# EAGLE design haasoscope_pro_clock_board (EAGLE 9.6.2)
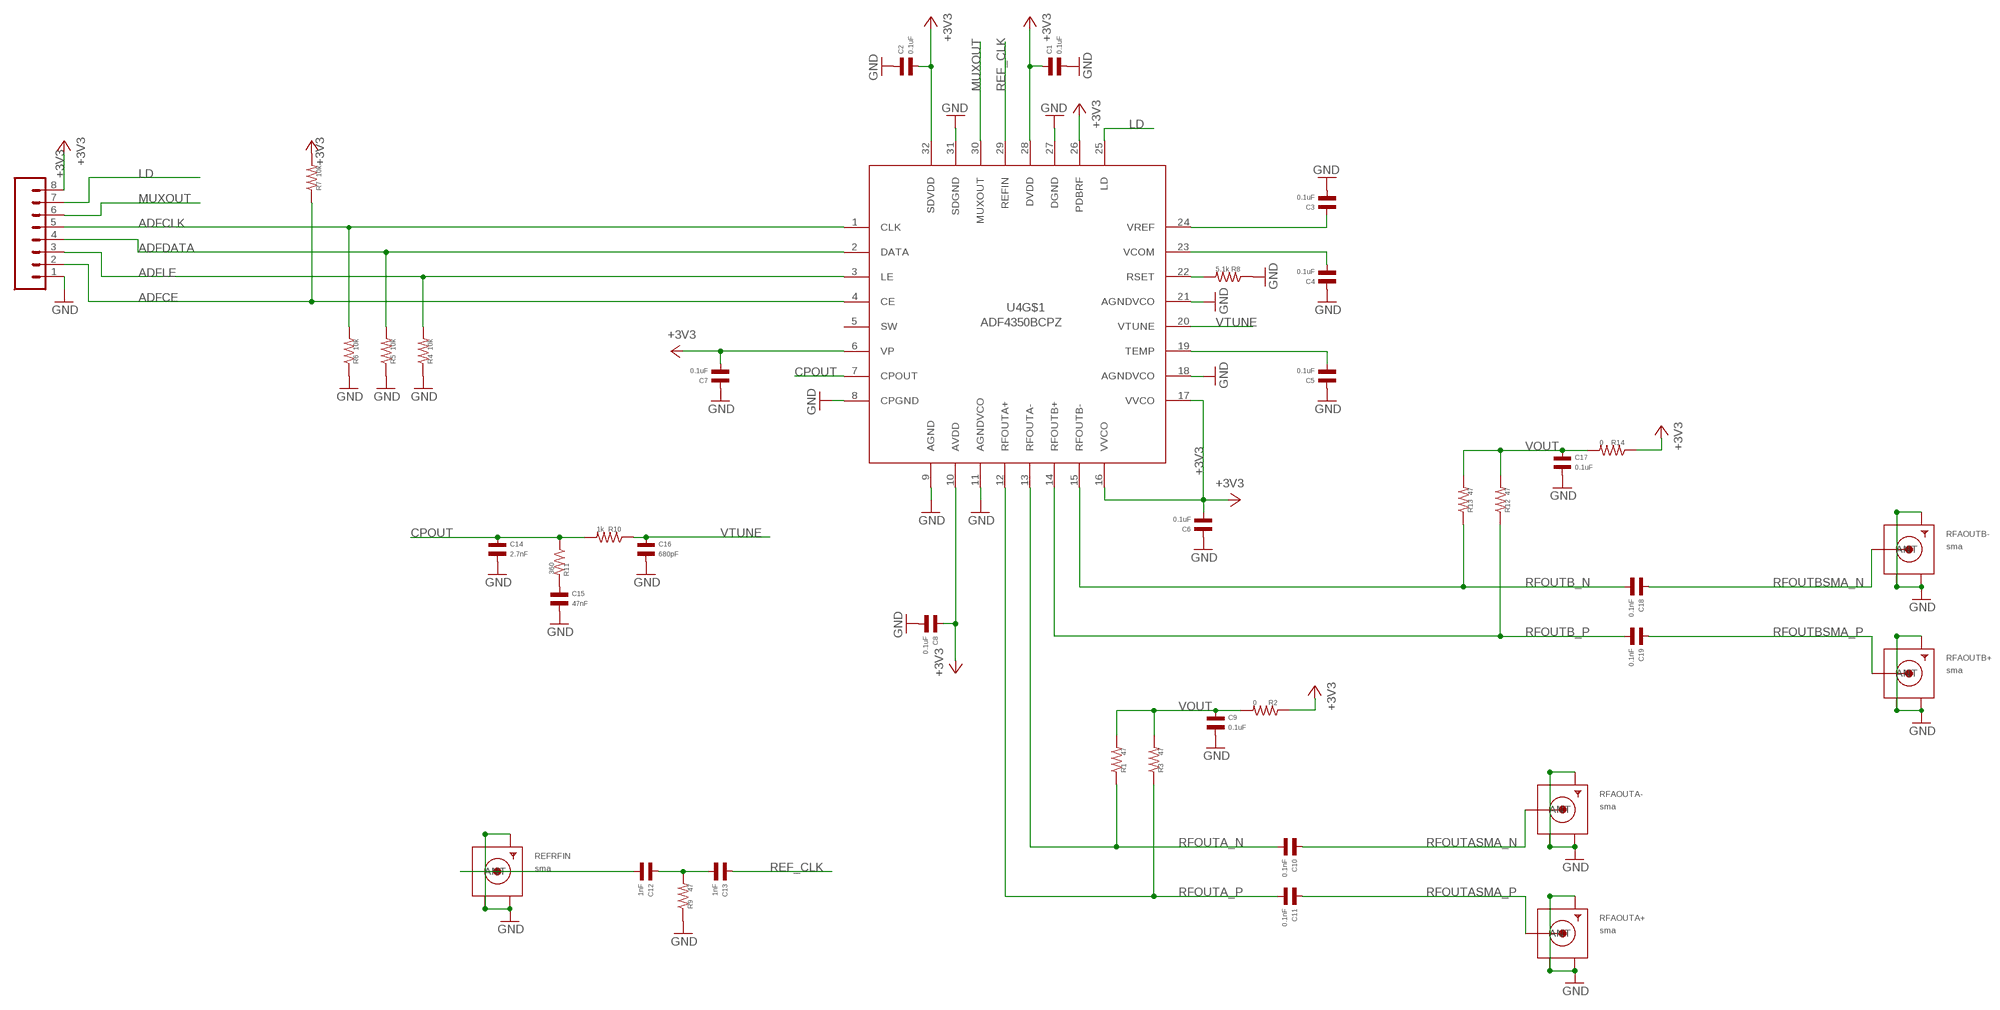
[diagram p0: schematic, sheet 1]

## Parts
C1  0.1uF  CAPACITOR_NP_0402  [C0402]
C2  0.1uF  CAPACITOR_NP_0402  [C0402]
C3  0.1uF  CAPACITOR_NP_0402  [C0402]
C4  0.1uF  CAPACITOR_NP_0402  [C0402]
C5  0.1uF  CAPACITOR_NP_0402  [C0402]
C6  0.1uF  CAPACITOR_NP_0402  [C0402]
C7  0.1uF  CAPACITOR_NP_0402  [C0402]
C8  0.1uF  CAPACITOR_NP_0402  [C0402]
C9  0.1uF  CAPACITOR_NP_0402  [C0402]
C10  0.1nF  CAPACITOR_NP_0402  [C0402]
C11  0.1nF  CAPACITOR_NP_0402  [C0402]
C12  1nF  CAPACITOR_NP_0402  [C0402]
C13  1nF  CAPACITOR_NP_0402  [C0402]
C14  2.7nF  CAPACITOR_NP_0402  [C0402]
C15  47nF  CAPACITOR_NP_0402  [C0402]
C16  680pF  CAPACITOR_NP_0402  [C0402]
C17  0.1uF  CAPACITOR_NP_0402  [C0402]
C18  0.1nF  CAPACITOR_NP_0402  [C0402]
C19  0.1nF  CAPACITOR_NP_0402  [C0402]
J4  8pin  CONN_08"  [1X08]
R1  47  RESISTOR_0402  [R0402]
R2  0  RESISTOR_0402  [R0402]
R3  47  RESISTOR_0402  [R0402]
R4  10k  RESISTOR_0402  [R0402]
R5  10k  RESISTOR_0402  [R0402]
R6  10k  RESISTOR_0402  [R0402]
R7  10k  RESISTOR_0402  [R0402]
R8  5.1k  RESISTOR_0402  [R0402]
R9  47  RESISTOR_0402  [R0402]
R10  1k  RESISTOR_0402  [R0402]
R11  360  RESISTOR_0402  [R0402]
R12  47  RESISTOR_0402  [R0402]
R13  47  RESISTOR_0402  [R0402]
R14  0  RESISTOR_0402  [R0402]
REFRFIN  sma  SMACONNECTOR_EDGE  [SMA_EDGELAUNCH]
RFAOUTA+  sma  SMACONNECTOR_EDGE  [SMA_EDGELAUNCH]
RFAOUTA-  sma  SMACONNECTOR_EDGE  [SMA_EDGELAUNCH]
RFAOUTB+  sma  SMACONNECTOR_EDGE  [SMA_EDGELAUNCH]
RFAOUTB-  sma  SMACONNECTOR_EDGE  [SMA_EDGELAUNCH]
U4  ADF4350BCPZ  [QFN50P500X500X100-33V2N]

## Nets
+3V3: C1.P$1 C2.P$2 C6.P$2 C7.P$2 C8.P$1 J4.8 R2.P$1 R7.P$2 R14.P$1 U4.6(VP) U4.10(AVDD) U4.16(VVCO) U4.17(VVCO) U4.26(PDBRF) U4.28(DVDD) U4.32(SDVDD)
ADFCE: J4.2 R7.P$1 U4.4(CE)
ADFCLK: J4.5 R6.P$2 U4.1(CLK)
ADFDATA: J4.4 R5.P$2 U4.2(DATA)
ADFLE: J4.3 R4.P$2 U4.3(LE)
CPOUT: C14.P$1 R10.P$2 R11.P$1 U4.7(CPOUT)
GND: C1.P$2 C2.P$1 C3.P$2 C4.P$1 C5.P$1 C6.P$1 C7.P$1 C8.P$2 C9.P$2 C14.P$2 C15.P$2 C16.P$2 C17.P$2 J4.1 R4.P$1 R5.P$1 R6.P$1 R8.P$1 R9.P$1 REFRFIN.GND@1(GND4) REFRFIN.GND@2(GND3) REFRFIN.GND@3(GND2) REFRFIN.GND@4(GND1) RFAOUTA+.GND@1(GND4) RFAOUTA+.GND@2(GND3) RFAOUTA+.GND@3(GND2) RFAOUTA+.GND@4(GND1) RFAOUTA-.GND@1(GND4) RFAOUTA-.GND@2(GND3) RFAOUTA-.GND@3(GND2) RFAOUTA-.GND@4(GND1) RFAOUTB+.GND@1(GND4) RFAOUTB+.GND@2(GND3) RFAOUTB+.GND@3(GND2) RFAOUTB+.GND@4(GND1) RFAOUTB-.GND@1(GND4) RFAOUTB-.GND@2(GND3) RFAOUTB-.GND@3(GND2) RFAOUTB-.GND@4(GND1) U4.8(CPGND) U4.9(AGND) U4.11(AGNDVCO) U4.18(AGNDVCO) U4.21(AGNDVCO) U4.27(DGND) U4.31(SDGND)
LD: J4.7 U4.25(LD)
MUXOUT: J4.6 U4.30(MUXOUT)
N$1: C12.P$2 REFRFIN.P(ANT)
N$2: C12.P$1 C13.P$2 R9.P$2
N$3: C15.P$1 R11.P$2
N$18: C5.P$2 U4.19(TEMP)
N$19: C4.P$2 U4.23(VCOM)
N$31: R8.P$2 U4.22(RSET)
REF_CLK: C13.P$1 U4.29(REFIN)
RFOUTA_N: C10.P$2 R1.P$1 U4.13(RFOUTA-)
RFOUTA_P: C11.P$2 R3.P$1 U4.12(RFOUTA+)
RFOUTASMA_N: C10.P$1 RFAOUTA-.P(ANT)
RFOUTASMA_P: C11.P$1 RFAOUTA+.P(ANT)
RFOUTB_N: C18.P$2 R13.P$1 U4.15(RFOUTB-)
RFOUTB_P: C19.P$2 R12.P$1 U4.14(RFOUTB+)
RFOUTBSMA_N: C18.P$1 RFAOUTB-.P(ANT)
RFOUTBSMA_P: C19.P$1 RFAOUTB+.P(ANT)
VOUT: C9.P$1 C17.P$1 R1.P$2 R2.P$2 R3.P$2 R12.P$2 R13.P$2 R14.P$2
VREF: C3.P$1 U4.24(VREF)
VTUNE: C16.P$1 R10.P$1 U4.20(VTUNE)
Unconnected: U4.5(SW)

## Power pins joined to a net without a drawn wire
GND: U4.PAD@1_1(GND) U4.PAD@1_2(GND) U4.PAD@1_3(GND) U4.PAD@2_1(GND) U4.PAD@2_2(GND) U4.PAD@2_3(GND) U4.PAD@3_1(GND) U4.PAD@3_2(GND) U4.PAD@3_3(GND)

## Library data of the parts
C1-C19 = MF_Passives:CAPACITOR_NP: Library: MF_Passives Description: Device for Non-Polarized Capacitors. Manufacture part number (MPN) can be added via Attributes. Check https://factory.macrofab.com/parts for the house parts list.; POPULATE: 1
J4 = SparkFun-Connectors:CONN_08: Multi connection point. Often used as Generic Header-pin footprint for 0.1 inch spaced/style header connections On any of the 0.1 inch spaced packages, you can populate with these: Break Away Headers - Straight <https://www.sparkfun.com/products/116> (PRT-00116) Break Away Male Headers - Right Angle <https://www.sparkfun.com/products/553> (PRT-00553) Female Headers <https://www.sparkfun.com/products/115> (PRT-00115) Break Away Headers - Machine Pin <https://www.sparkfun.com/products/117> (PRT-00117) Break Away Female Headers - Swiss Machine Pin <https://www.sparkfun.com/products/743> (PRT-00743) Arduino Stackable Header - 8 Pin <https://www.sparkfun.com/products/9279> (PRT-09279) For SCREWTERMINALS and SPRING TERMINALS visit here: Screw Terimnals on SparkFun.com <https://www.sparkfun.com/search/results?term=Screw+Terminals> (5mm/3.5mm/2.54mm spacing) This device is also useful as a general connection point to wire up your design to another part of your project. Our various solder wires solder well into these plated through hole pads. Hook-Up Wire - Assortment (Stranded, 22 AWG) <https://www.sparkfun.com/products/11375> (PRT-11375) Hook-Up Wire - Assortment (Solid Core, 22 AWG) <https://www.sparkfun.com/products/11367> (PRT-11367) View the entire wire category on our website here <https://www.sparkfun.com/categories/141> Special notes: Molex polarized connector foot print use with SKU : PRT-08231 with associated crimp pins and housings. 1MM SMD Version SKU: PRT-10208 NOTES ON THE VARIANTS LOCK and LOCK_LONGPADS... This footprint was designed to help hold the alignment of a through-hole component (i.e. 6-pin header) while soldering it into place. You may notice that each hole has been shifted either up or down by 0.005 of an inch from it's more standard position (which is a perfectly straight line). This slight alteration caused the pins (the squares in the middle) to touch the edges of the holes. Because they are alternating, it causes a "brace" to hold the component in place. 0.005 has proven to be the perfect amount of "off-center" position when using our standard breakaway headers. Although looks a little odd when you look at the bare footprint, once you have a header in there, the alteration is very hard to notice. Also,if you push a header all the way into place, it is covered up entirely on the bottom side.; PROD_ID: CONN-08438
R1-R14 = MF_Passives:RESISTOR: Library: MF_Passives Description: Device for Resistors. Manufacture part number (MPN), Voltage, Tolerance, and Wattage Rating can be added via Attributes. Check https://factory.macrofab.com/parts for the house parts list.; POPULATE: 1
REFRFIN RFAOUTA+ RFAOUTA- RFAOUTB+ RFAOUTB- = adafruit:SMACONNECTOR: SMA Connector 90° DIP SMA Connector, 50 Ohm (4UConnector: 07259)
U4 = analog_devices:ADF4350

## Net classes
0 default: width 0.305 mm

## Board
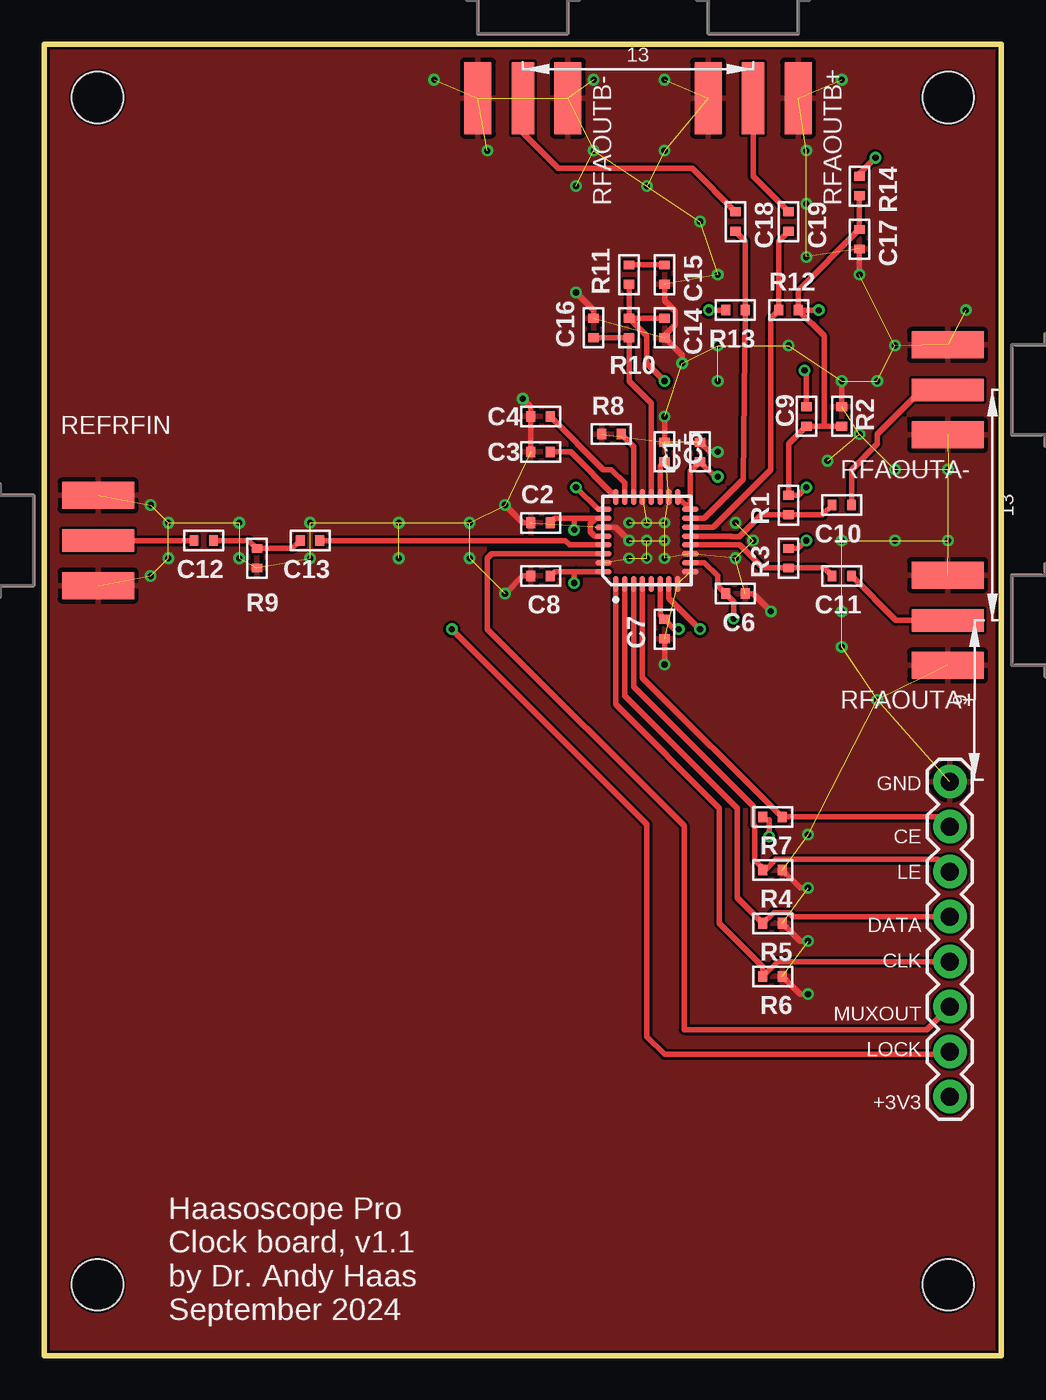
[diagram p1: board, top side]
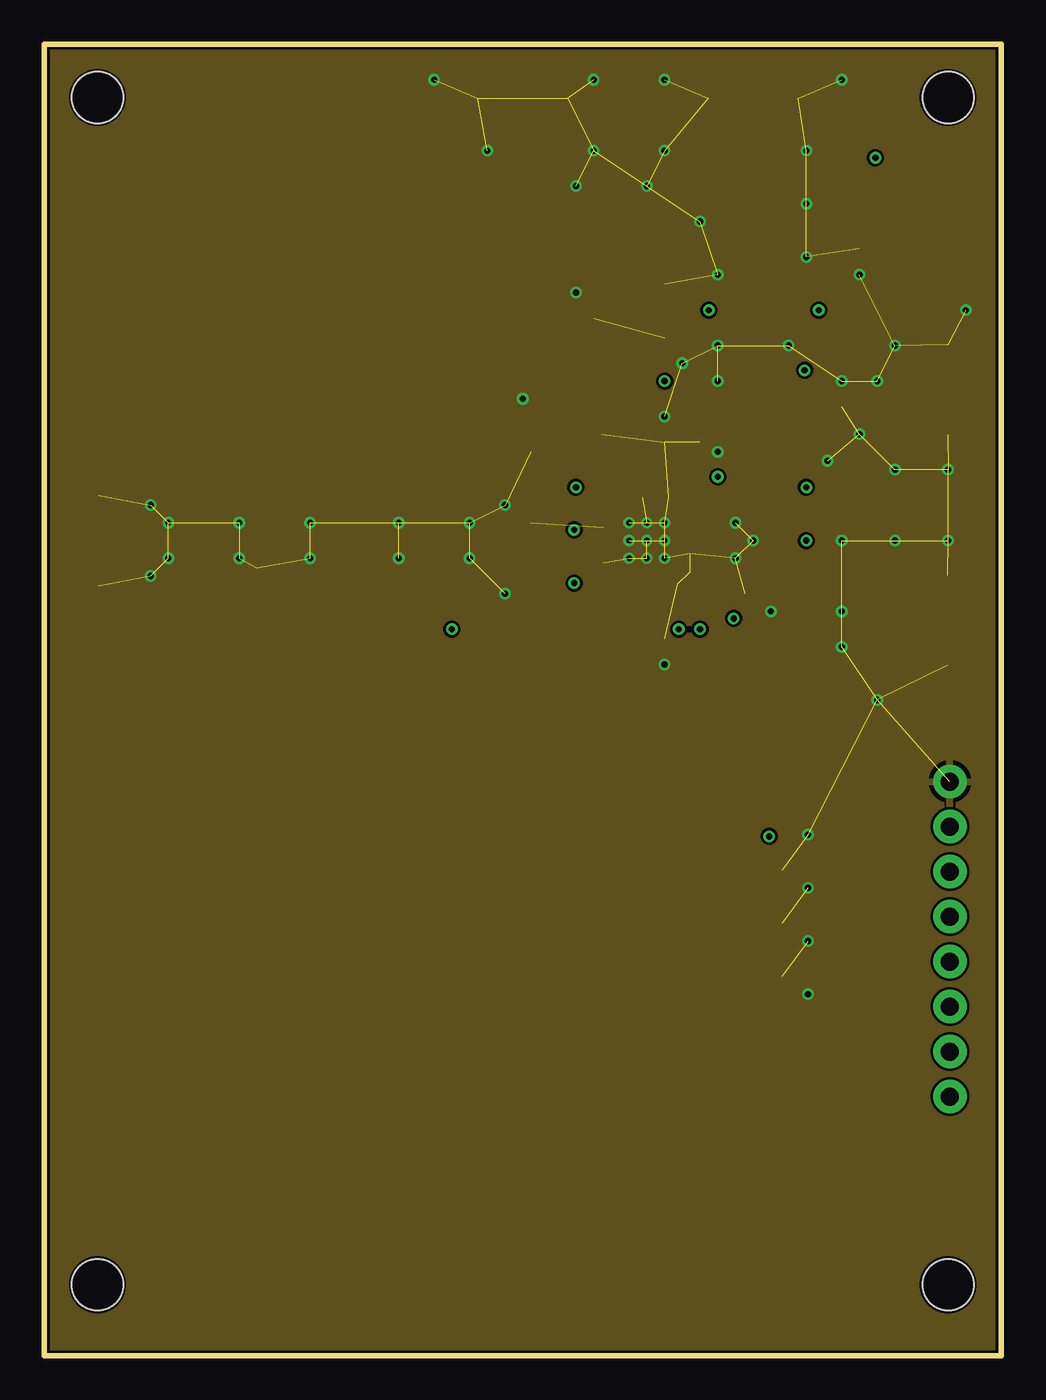
[diagram p2: board, inner layer topgnd]
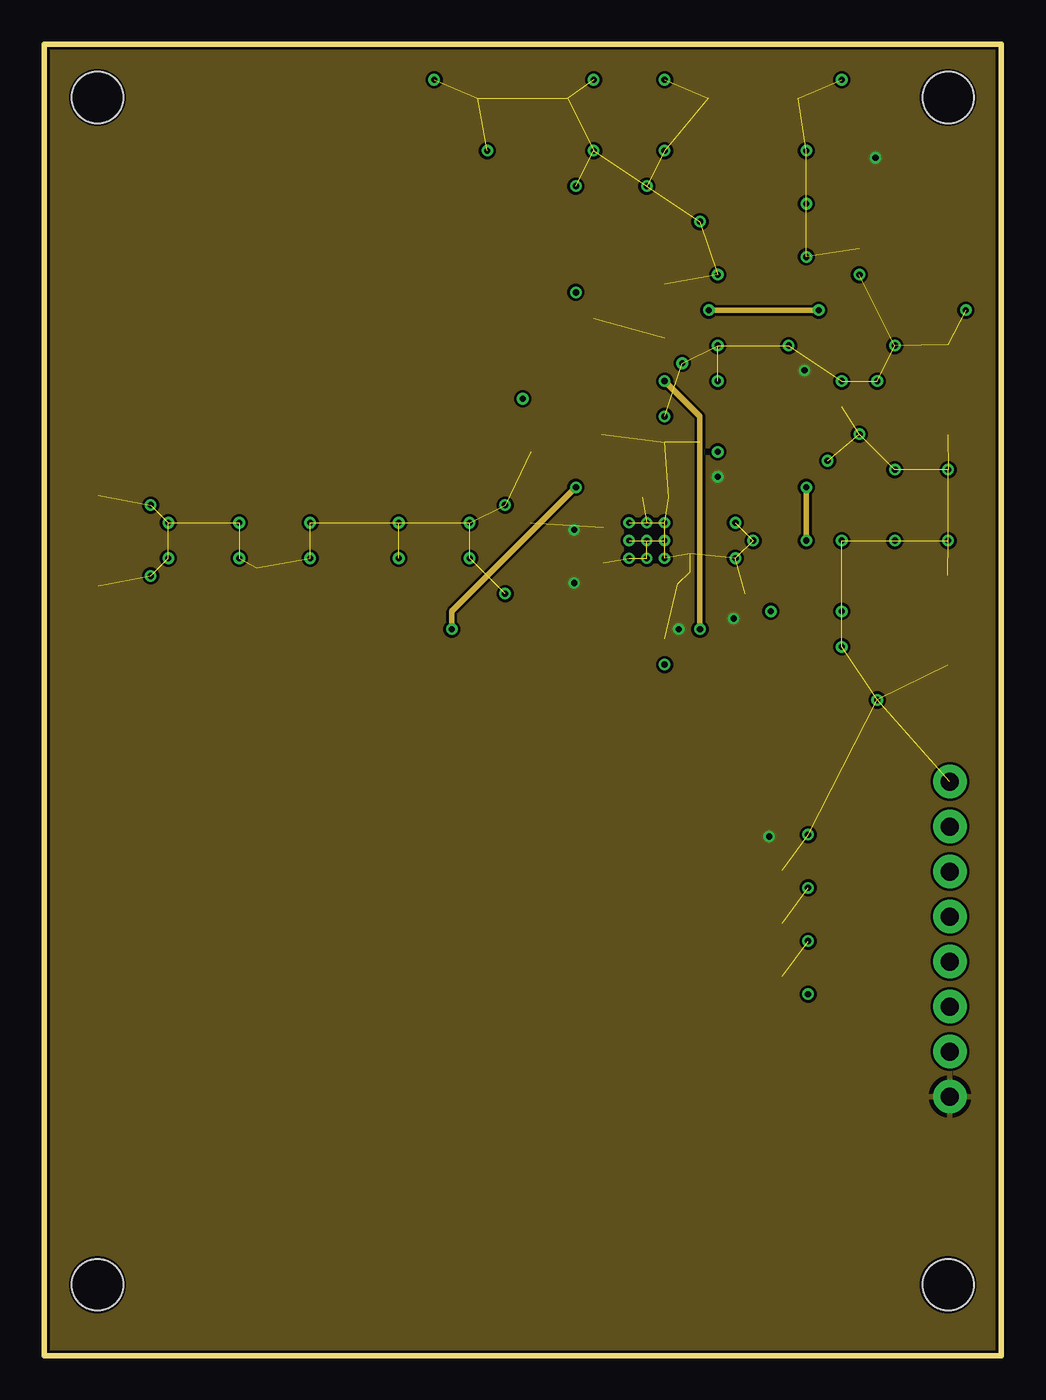
[diagram p3: board, inner layer route]
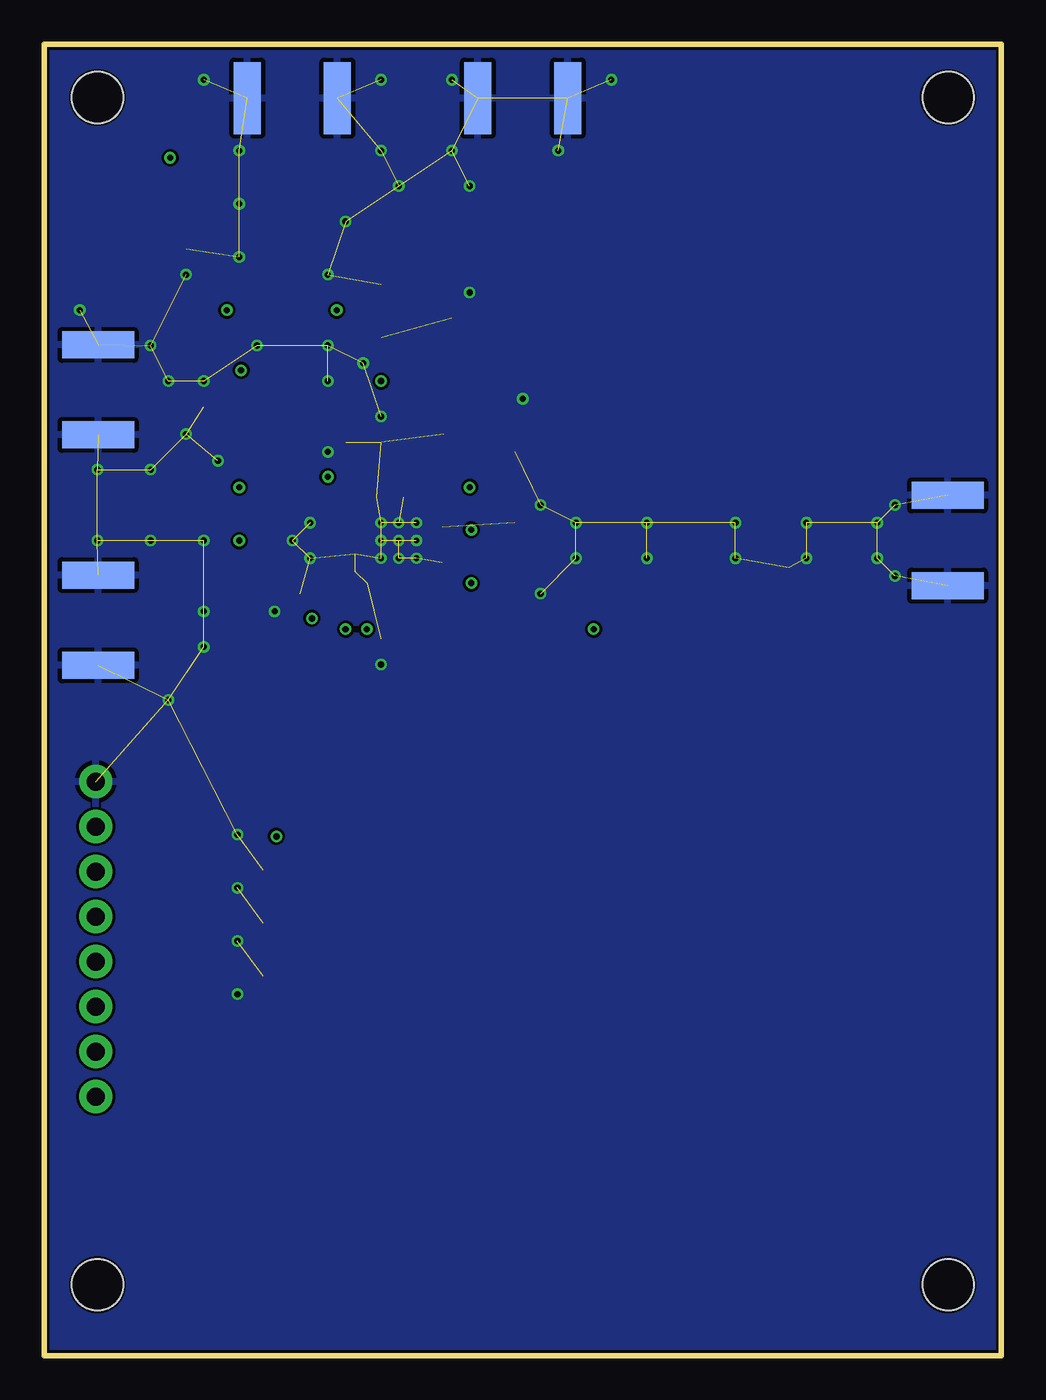
[diagram p4: board, bottom side, seen from below]

Size 54 x 74 mm. Coordinates in mm from the lower left corner, seen from the top.
Outline: 0,74 0,0 54,0 54,74 0,74
Copper layers (1*2*15*16): top 0.035mm / dielectric 0.2mm / topgnd 0.0175mm / dielectric 0.3mm / route 0.0175mm / dielectric 0.2mm / gnd 0.035mm
Design rules "Seeed_AllPCB_MacroFab_haas6mil *": minimum track width 6mil, minimum drill 12mil, track to track 6mil, track to pad 6mil, pad to pad 6mil, via to via 6mil, smd to smd 0mil, copper to edge 6mil, drill to drill 6mil, minimum pad ring 6mil, minimum via ring 6mil, stop-mask expansion 6mil, vias tented up to drill 25mil, thermal gap 10mil
Holes 2.9 mm at 51,71 3,71 3,4 51,4

### Footprints (pad centres in the part's own frame; a part is rotated, then mirrored left to right if it is on the bottom)
C0402 = smd 0.5 x 0.6: P$1 -0.55,0; P$2 0.55,0
1X08 = drill 1.016 pad 1.88: 1 0,0; 2 2.54,0; 3 5.08,0; 4 7.62,0; 5 10.16,0; 6 12.7,0; 7 15.24,0; 8 17.78,0
R0402 = smd 0.5 x 0.6: P$1 -0.55,0; P$2 0.55,0
SMA_EDGELAUNCH = smd 4.064 x 1.524: GND@1 2.032,-2.54; GND@2 2.032,2.54 | smd 4.064 x 1.524 bottom: GND@3 2.032,2.54; GND@4 2.032,-2.54 | smd 4.064 x 1.27: P 2.032,0
QFN50P500X500X100-33V2N = smd 0.9 x 0.3: 1 -2.45,1.75; 2 -2.45,1.25; 3 -2.45,0.75; 4 -2.45,0.25; 5 -2.45,-0.25; 6 -2.45,-0.75; 7 -2.45,-1.25; 8 -2.45,-1.75; 17 2.45,-1.75; 18 2.45,-1.25; 19 2.45,-0.75; 20 2.45,-0.25; 21 2.45,0.25; 22 2.45,0.75; 23 2.45,1.25; 24 2.45,1.75 | smd 0.3 x 0.9: 9 -1.75,-2.45; 10 -1.25,-2.45; 11 -0.75,-2.45; 12 -0.25,-2.45; 13 0.25,-2.45; 14 0.75,-2.45; 15 1.25,-2.45; 16 1.75,-2.45; 25 1.75,2.45; 26 1.25,2.45; 27 0.75,2.45; 28 0.25,2.45; 29 -0.25,2.45; 30 -0.75,2.45; 31 -1.25,2.45; 32 -1.75,2.45 | drill 0.33: PAD@1_1 -1,1; PAD@1_2 -1,0; PAD@1_3 -1,-1; PAD@2_1 0,1; PAD@2_2 0,0; PAD@2_3 0,-1; PAD@3_1 1,1; PAD@3_2 1,0; PAD@3_3 1,-1

### Placement (x,y rotation side)
C1  37,51 90 top
C2  28,47 0 top
C3  28,51 180 top
C4  28,53 0 top
C5  35,51 270 top
C6  39,43 180 top
C7  35,41 90 top
C8  28,44 180 top
C9  45,53 90 top
C10  45,48 180 top
C11  45,44 180 top
C12  9,46 180 top
C13  15,46 180 top
C14  35,58 270 top
C15  35,61 270 top
C16  31,58 90 top
C17  46,63 270 top
C18  39,64 270 top
C19  42,64 270 top
J4  51.1,32.4 270 top
R1  42,48 90 top
R2  43,53 270 top
R3  42,45 90 top
R4  41.1,27.4 180 top
R5  41.1,24.4 180 top
R6  41.1,21.4 180 top
R7  41.1,30.4 180 top
R8  32,52 0 top
R9  12,45 90 top
R10  33,58 90 top
R11  33,61 90 top
R12  42,59 0 top
R13  39,59 180 top
R14  46,66 270 top
REFRFIN  1,46 0 top
RFAOUTA+  53,41.5 180 top
RFAOUTA-  53,54.5 180 top
RFAOUTB+  40,73 270 top
RFAOUTB-  27,73 270 top
U4  34,46 90 top

### Tracks (layer width: path | path; a pad name or v marks a point on that pad's centre or on a via)
+3V3  (via drill 0.35)
  top 0.305: U4.6 34.75,41.8 C7.P$2 35.55,41 v35.8,41 | U4.10 37.25,44.75 38,44 38,43.45 C6.P$2 38.9,42.55 v38.9,41.6 | C8.P$1 28.8,44.25 30,44.25 | 30,44.25 U4.32 | C2.P$2 28.8,47.25 30,47.25 | U4.28 31.05,46.25 30.8,46.5 30.8,46.56 30.8,46.94 31.11,47.25 U4.26 30,47.25 | U4.17 U4.16 36.45,49.9 C1.P$1 37.85,49.6 v38,49.6 | v42.9,55.6 43,55.5 R2.P$1 | v29.9,46.6 29.9,47.15 30,47.25 | v29.9,43.6 29.9,44.15 30,44.25 | R7.P$2 40.55,30.3 40.6,30.25 40.9,30.23 v40.9,29.3 | R14.P$1 46,66.7 v46.9,67.6
  pour route: 57,76 57,-5 -2,-5 -2,76
ADFCE
  top 0.305: J4.2 50.56,30.4 R7.P$1 41.6,30.4 33.75,38.25 U4.4
ADFCLK
  top 0.305: J4.5 41.39,22.24 R6.P$2 40.55,21.95 38.1,24.4 38.1,30.9 32.25,36.75 U4.1
ADFDATA
  top 0.305: J4.4 42.25,24.78 42.03,25 41.16,25 R5.P$2 39.1,25.85 39.1,30.9 32.75,37.25 U4.2
ADFLE
  top 0.305: R4.P$2 40.67,27.4 | 40.67,27.4 41.27,28 50.41,28 J4.3 | U4.3 33.25,37.75 39.99,31 39.99,29.97 40.1,29.87 40.1,27.97 40.67,27.4
CPOUT  (via drill 0.35)
  top 0.305: R10.P$2 C14.P$1 | R10.P$2 R11.P$1 | R10.P$2 34,57.55 34,56 v35,55 | v37,41 35.25,42.75 U4.7
  route 0.305: v35,55 37,53 v37,41
GND  (via drill 0.35)  (97 unrouted)
  top 0.305: C15.P$2 35,59.53 35.6,58.93 35.6,58.17 35,57.57 C14.P$2 36,56.45 v36,56 | U4.27 32.25,46.75 U4.PAD@2_1 | v30,60 31,59 C16.P$2 | C9.P$2 v45,55 | v38,51 37.55,51 C1.P$2 | C6.P$1 40,43 v41,42 | v35,39 C7.P$1 | v26,43 27,44 C8.P$2 | v26,48 27,47 C2.P$1 | v27,54 27.45,53.55 C4.P$1 C3.P$2 | v43.1,26.4 42.65,26.4 R4.P$1 | v43.1,23.4 42.65,23.4 R5.P$1 | v43.1,20.4 42.65,20.4 R6.P$1 | v35,53 C5.P$1 | C17.P$2 v46,61
  other vias: 43.1,29.4 6,44 7,45 7,47 6,48 11,47 11,45 15,47 15,45 20,45 20,47 24,47 24,45 45,46 48,50 51,50 48,57 47,55 46,52 44.2,50.5 39,47 39,45 40,46 45,42 45,40 47,37 48,46 51,46 43,68 43,65 43,62 42,57 38,57 38,61 37,64 34,66 30,66 25,68 31,68 35,68 35,72 31,72 52,59 45,72 22,72 38,55
  pour gnd: 56,75 56,-2 -1,-2 -1,75
  pour topgnd: 59,77 59,-3 -4,-3 -4,77
  pour top: 58,78 58,-6 -6,-6 -6,78
LD  (via drill 0.35)
  top 0.305: v30,49 31.25,47.75 U4.25 | v23,41 34,30 34,18 35,17 50.94,17 J4.7
  route 0.305: v23,41 23,42 v30,49
MUXOUT
  top 0.305: U4.30 25.25,45.25 25,45 25,41 36.1,29.9 36.1,18.4 49.8,18.4 J4.6
N$1
  top 0.305: REFRFIN.P C12.P$2
N$2
  top 0.305: C12.P$1 11.55,46 R9.P$2 14,45.55 C13.P$2
N$3
  top 0.305: R11.P$2 C15.P$1
N$18
  top 0.305: U4.19 34.75,50.2 C5.P$2
N$19
  top 0.305: C4.P$2 31.55,50 32,50 32.75,49.25 U4.23
N$31
  top 0.305: R8.P$2 33.25,51.3 U4.22
REF_CLK
  top 0.305: U4.29 29.65,45.75 29.4,46 C13.P$1
RFOUTA_N
  top 0.305: U4.13 38.75,46.25 38.79,46.21 39.21,46.21 40.45,47.45 R1.P$1 43.9,47.45 C10.P$2
RFOUTA_P
  top 0.305: U4.12 39.25,45.75 40.55,44.45 R3.P$1 44,44.45 C11.P$2
RFOUTASMA_N
  top 0.305: C10.P$1 45.55,50 47,51.45 47,52 49.5,54.5 RFAOUTA-.P
RFOUTASMA_P
  top 0.305: C11.P$1 48.05,41.5 RFAOUTA+.P
RFOUTB_N
  top 0.305: U4.15 37.25,47.25 39.45,49.45 R13.P$1 39.55,62.9 C18.P$2
RFOUTB_P
  top 0.305: U4.14 37.75,46.75 41,50 41,58.55 R12.P$1 41.45,62.9 C19.P$2
RFOUTBSMA_N
  top 0.305: C18.P$1 36.55,67 29,67 27,69 RFAOUTB-.P
RFOUTBSMA_P
  top 0.305: C19.P$1 40,66.55 RFAOUTB+.P
VOUT  (via drill 0.35)
  top 0.305: C9.P$1 44,52.45 | 44,52.45 R2.P$2 42,51.45 R1.P$2 42.55,48.55 v43,49 | v43,46 42.55,45.55 R3.P$2 | R12.P$2 42.55,60.1 C17.P$1 R14.P$2 | R12.P$2 44,57.55 44,52.45 | R13.P$2 v37.5,59 | v43.7,59 R12.P$2
  route 0.305: v43,49 v43,46 | v37.5,59 v43.7,59
VREF
  top 0.305: C3.P$1 29.7,51 U4.24
VTUNE
  top 0.305: C16.P$1 R10.P$1 33,55 34.25,53.75 U4.20

### Text on the board
tPlace: GND | CE | LE | DATA | CLK | MUXOUT | LOCK | +3V3 | Haasoscope Pro / Clock board, v1.1 / by Dr. Andy Haas / September 2024